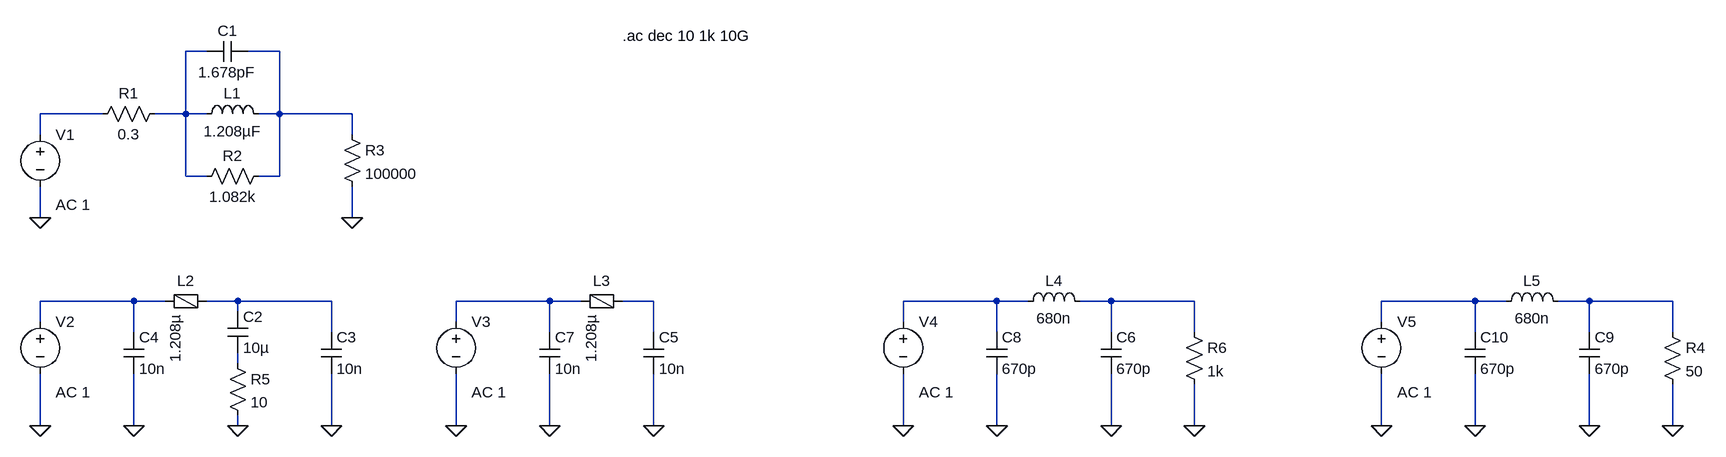
[diagram p0: schematic Supply EMI Filter.asc]
Supply EMI Filter.asc, the LTspice schematic file:
Version 4
SHEET 1 2808 680
WIRE 288 64 256 64
WIRE 400 64 352 64
WIRE 128 160 32 160
WIRE 256 160 256 64
WIRE 256 160 208 160
WIRE 288 160 256 160
WIRE 400 160 400 64
WIRE 400 160 368 160
WIRE 512 160 400 160
WIRE 32 192 32 160
WIRE 512 192 512 160
WIRE 256 256 256 160
WIRE 288 256 256 256
WIRE 400 256 400 160
WIRE 400 256 368 256
WIRE 32 320 32 272
WIRE 512 320 512 272
WIRE 176 448 32 448
WIRE 224 448 176 448
WIRE 336 448 288 448
WIRE 480 448 336 448
WIRE 816 448 672 448
WIRE 864 448 816 448
WIRE 976 448 928 448
WIRE 1504 448 1360 448
WIRE 1552 448 1504 448
WIRE 1680 448 1632 448
WIRE 1808 448 1680 448
WIRE 2240 448 2096 448
WIRE 2288 448 2240 448
WIRE 2416 448 2368 448
WIRE 2544 448 2416 448
WIRE 336 464 336 448
WIRE 32 480 32 448
WIRE 672 480 672 448
WIRE 1360 480 1360 448
WIRE 2096 480 2096 448
WIRE 176 496 176 448
WIRE 480 496 480 448
WIRE 816 496 816 448
WIRE 976 496 976 448
WIRE 1504 496 1504 448
WIRE 1680 496 1680 448
WIRE 1808 496 1808 448
WIRE 2240 496 2240 448
WIRE 2416 496 2416 448
WIRE 2544 496 2544 448
WIRE 336 544 336 528
WIRE 32 640 32 560
WIRE 176 640 176 560
WIRE 336 640 336 624
WIRE 480 640 480 560
WIRE 672 640 672 560
WIRE 816 640 816 560
WIRE 976 640 976 560
WIRE 1360 640 1360 560
WIRE 1504 640 1504 560
WIRE 1680 640 1680 560
WIRE 1808 640 1808 576
WIRE 2096 640 2096 560
WIRE 2240 640 2240 560
WIRE 2416 640 2416 560
WIRE 2544 640 2544 576
FLAG 32 320 0
FLAG 512 320 0
FLAG 32 640 0
FLAG 480 640 0
FLAG 336 640 0
FLAG 176 640 0
FLAG 672 640 0
FLAG 976 640 0
FLAG 816 640 0
FLAG 1360 640 0
FLAG 1680 640 0
FLAG 1504 640 0
FLAG 2096 640 0
FLAG 2416 640 0
FLAG 2240 640 0
FLAG 2544 640 0
FLAG 1808 640 0
SYMBOL res 224 144 R90
WINDOW 0 0 56 VBottom 2
WINDOW 3 32 56 VTop 2
SYMATTR InstName R1
SYMATTR Value 0.3
SYMBOL res 384 240 R90
WINDOW 0 0 56 VBottom 2
WINDOW 3 32 56 VTop 2
SYMATTR InstName R2
SYMATTR Value 1.082k
SYMBOL cap 352 48 R90
WINDOW 0 0 32 VBottom 2
WINDOW 3 32 32 VTop 2
SYMATTR InstName C1
SYMATTR Value 1.678pF
SYMBOL ind 272 176 R270
WINDOW 0 32 56 VTop 2
WINDOW 3 5 56 VBottom 2
SYMATTR InstName L1
SYMATTR Value 1.208µF
SYMBOL voltage 32 176 R0
WINDOW 123 24 124 Left 2
WINDOW 39 0 0 Left 2
SYMATTR Value2 AC 1
SYMATTR InstName V1
SYMATTR Value ""
SYMBOL res 496 176 R0
SYMATTR InstName R3
SYMATTR Value 100000
SYMBOL FerriteBead 256 448 R90
WINDOW 0 -16 0 VBottom 2
SYMATTR InstName L2
SYMATTR Value 1.208µ
SYMATTR SpiceLine Rser=0.3 Rpar=1.082k Cpar=1.678p
SYMBOL voltage 32 464 R0
WINDOW 123 24 124 Left 2
WINDOW 39 0 0 Left 2
SYMATTR Value2 AC 1
SYMATTR InstName V2
SYMATTR Value ""
SYMBOL cap 464 496 R0
SYMATTR InstName C3
SYMATTR Value 10n
SYMBOL cap 320 464 R0
SYMATTR InstName C2
SYMATTR Value 10µ
SYMBOL res 320 528 R0
SYMATTR InstName R5
SYMATTR Value 10
SYMBOL cap 160 496 R0
SYMATTR InstName C4
SYMATTR Value 10n
SYMBOL FerriteBead 896 448 R90
WINDOW 0 -16 0 VBottom 2
SYMATTR InstName L3
SYMATTR Value 1.208µ
SYMATTR SpiceLine Rser=0.3 Rpar=1.082k Cpar=1.678p
SYMBOL voltage 672 464 R0
WINDOW 123 24 124 Left 2
WINDOW 39 0 0 Left 2
SYMATTR Value2 AC 1
SYMATTR InstName V3
SYMATTR Value ""
SYMBOL cap 960 496 R0
SYMATTR InstName C5
SYMATTR Value 10n
SYMBOL cap 800 496 R0
SYMATTR InstName C7
SYMATTR Value 10n
SYMBOL voltage 1360 464 R0
WINDOW 123 24 124 Left 2
WINDOW 39 0 0 Left 2
SYMATTR Value2 AC 1
SYMATTR InstName V4
SYMATTR Value ""
SYMBOL cap 1664 496 R0
SYMATTR InstName C6
SYMATTR Value 670p
SYMBOL cap 1488 496 R0
SYMATTR InstName C8
SYMATTR Value 670p
SYMBOL ind 1536 464 R270
WINDOW 0 32 56 VTop 2
WINDOW 3 5 56 VBottom 2
SYMATTR InstName L4
SYMATTR Value 680n
SYMBOL voltage 2096 464 R0
WINDOW 123 24 124 Left 2
WINDOW 39 0 0 Left 2
SYMATTR Value2 AC 1
SYMATTR InstName V5
SYMATTR Value ""
SYMBOL cap 2400 496 R0
SYMATTR InstName C9
SYMATTR Value 670p
SYMBOL cap 2224 496 R0
SYMATTR InstName C10
SYMATTR Value 670p
SYMBOL ind 2272 464 R270
WINDOW 0 32 56 VTop 2
WINDOW 3 5 56 VBottom 2
SYMATTR InstName L5
SYMATTR Value 680n
SYMBOL res 2528 480 R0
SYMATTR InstName R4
SYMATTR Value 50
SYMBOL res 1792 480 R0
SYMATTR InstName R6
SYMATTR Value 1k
TEXT 928 40 Left 2 !.ac dec 10 1k 10G

The netlist it stands for:
* Supply EMI Filter.asc
R1 N001 N003 0.3
R2 N002 N001 1.082k
C1 N002 N001 1.678pF
L1 N001 N002 1.208µF
V1 N003 0 AC 1
R3 N002 0 100000
L2 N005 N004 1.208µ Rser=0.3 Rpar=1.082k Cpar=1.678p
V2 N004 0 AC 1
C3 N005 0 10n
C2 N005 N012 10µ
R5 N012 0 10
C4 N004 0 10n
L3 N007 N006 1.208µ Rser=0.3 Rpar=1.082k Cpar=1.678p
V3 N006 0 AC 1
C5 N007 0 10n
C7 N006 0 10n
V4 N008 0 AC 1
C6 N009 0 670p
C8 N008 0 670p
L4 N008 N009 680n
V5 N010 0 AC 1
C9 N011 0 670p
C10 N010 0 670p
L5 N010 N011 680n
R4 N011 0 50
R6 N009 0 1k
.ac dec 10 1k 10G
.backanno
.end